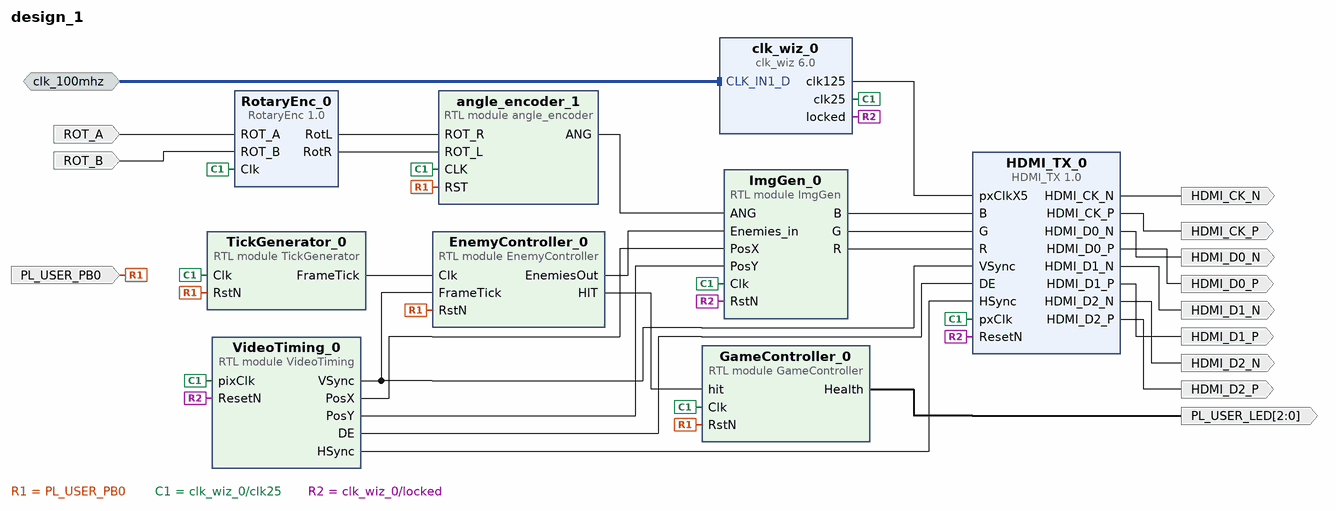
[diagram p0: block diagram of the top level]
# Vivado block design design_1, xczu3eg-sfvc784-2-e, Vivado 2025.1
create_bd_design design_1

create_bd_intf_port -mode Slave -vlnv xilinx.com:interface:diff_clock_rtl:1.0 clk_100mhz
set_property -dict {CONFIG.FREQ_HZ 100000000} [get_bd_intf_ports clk_100mhz]
create_bd_port -dir O HDMI_D0_P
create_bd_port -dir O HDMI_D0_N
create_bd_port -dir O HDMI_D1_P
create_bd_port -dir O HDMI_D1_N
create_bd_port -dir O HDMI_D2_P
create_bd_port -dir O HDMI_D2_N
create_bd_port -dir O HDMI_CK_P
create_bd_port -dir O HDMI_CK_N
create_bd_port -dir I ROT_A
create_bd_port -dir I ROT_B
create_bd_port -dir I PL_USER_PB0
create_bd_port -dir O -from 2 -to 0 PL_USER_LED

create_bd_cell -type ip -vlnv xilinx.com:ip:clk_wiz:6.0 clk_wiz_0
set_property -dict [list \
  CONFIG.CLKOUT1_JITTER 148.007 \
  CONFIG.CLKOUT1_PHASE_ERROR 84.520 \
  CONFIG.CLKOUT1_REQUESTED_OUT_FREQ 25 \
  CONFIG.CLKOUT1_USED true \
  CONFIG.CLKOUT2_JITTER 107.502 \
  CONFIG.CLKOUT2_PHASE_ERROR 84.520 \
  CONFIG.CLKOUT2_REQUESTED_OUT_FREQ 125 \
  CONFIG.CLKOUT2_USED true \
  CONFIG.CLK_IN1_BOARD_INTERFACE clk_100mhz \
  CONFIG.CLK_OUT1_PORT clk25 \
  CONFIG.CLK_OUT2_PORT clk125 \
  CONFIG.MMCM_CLKFBOUT_MULT_F 12.500 \
  CONFIG.MMCM_CLKOUT0_DIVIDE_F 50.000 \
  CONFIG.MMCM_CLKOUT1_DIVIDE 10 \
  CONFIG.MMCM_DIVCLK_DIVIDE 1 \
  CONFIG.NUM_OUT_CLKS 2 \
  CONFIG.USE_BOARD_FLOW true \
] [get_bd_cells clk_wiz_0]
create_bd_cell -type ip -vlnv JS_WUST:UCiSW:HDMI_TX:1.0 HDMI_TX_0
create_bd_cell -type module -reference VideoTiming VideoTiming_0
create_bd_cell -type module -reference ImgGen ImgGen_0
create_bd_cell -type ip -vlnv JS_WUST:UCiSW:RotaryEnc:1.0 RotaryEnc_0
create_bd_cell -type module -reference angle_encoder angle_encoder_1
create_bd_cell -type module -reference EnemyController EnemyController_0
create_bd_cell -type module -reference TickGenerator TickGenerator_0
create_bd_cell -type module -reference GameController GameController_0

# ---- connections ----

connect_bd_intf_net [get_bd_intf_ports clk_100mhz] [get_bd_intf_pins clk_wiz_0/CLK_IN1_D]
connect_bd_net [get_bd_pins EnemyController_0/EnemiesOut] [get_bd_pins ImgGen_0/Enemies_in]
connect_bd_net [get_bd_pins EnemyController_0/HIT] [get_bd_pins GameController_0/hit]
connect_bd_net [get_bd_pins GameController_0/Health] [get_bd_ports PL_USER_LED]
connect_bd_net [get_bd_pins HDMI_TX_0/HDMI_CK_N] [get_bd_ports HDMI_CK_N]
connect_bd_net [get_bd_pins HDMI_TX_0/HDMI_CK_P] [get_bd_ports HDMI_CK_P]
connect_bd_net [get_bd_pins HDMI_TX_0/HDMI_D0_N] [get_bd_ports HDMI_D0_N]
connect_bd_net [get_bd_pins HDMI_TX_0/HDMI_D0_P] [get_bd_ports HDMI_D0_P]
connect_bd_net [get_bd_pins HDMI_TX_0/HDMI_D1_N] [get_bd_ports HDMI_D1_N]
connect_bd_net [get_bd_pins HDMI_TX_0/HDMI_D1_P] [get_bd_ports HDMI_D1_P]
connect_bd_net [get_bd_pins HDMI_TX_0/HDMI_D2_N] [get_bd_ports HDMI_D2_N]
connect_bd_net [get_bd_pins HDMI_TX_0/HDMI_D2_P] [get_bd_ports HDMI_D2_P]
connect_bd_net [get_bd_pins ImgGen_0/B] [get_bd_pins HDMI_TX_0/B]
connect_bd_net [get_bd_pins ImgGen_0/G] [get_bd_pins HDMI_TX_0/G]
connect_bd_net [get_bd_pins ImgGen_0/R] [get_bd_pins HDMI_TX_0/R]
connect_bd_net -net PL_USER_PB0_1 [get_bd_ports PL_USER_PB0] \
  [get_bd_pins angle_encoder_1/RST] [get_bd_pins TickGenerator_0/RstN] [get_bd_pins EnemyController_0/RstN] \
  [get_bd_pins GameController_0/RstN]
connect_bd_net [get_bd_ports ROT_A] [get_bd_pins RotaryEnc_0/ROT_A]
connect_bd_net [get_bd_ports ROT_B] [get_bd_pins RotaryEnc_0/ROT_B]
connect_bd_net [get_bd_pins RotaryEnc_0/RotL] [get_bd_pins angle_encoder_1/ROT_R]
connect_bd_net [get_bd_pins RotaryEnc_0/RotR] [get_bd_pins angle_encoder_1/ROT_L]
connect_bd_net [get_bd_pins TickGenerator_0/FrameTick] [get_bd_pins EnemyController_0/Clk]
connect_bd_net [get_bd_pins VideoTiming_0/DE] [get_bd_pins HDMI_TX_0/DE]
connect_bd_net [get_bd_pins VideoTiming_0/HSync] [get_bd_pins HDMI_TX_0/HSync]
connect_bd_net [get_bd_pins VideoTiming_0/PosX] [get_bd_pins ImgGen_0/PosX]
connect_bd_net [get_bd_pins VideoTiming_0/PosY] [get_bd_pins ImgGen_0/PosY]
connect_bd_net [get_bd_pins VideoTiming_0/VSync] [get_bd_pins HDMI_TX_0/VSync] [get_bd_pins EnemyController_0/FrameTick]
connect_bd_net -net angle_encoder_0_ANG [get_bd_pins angle_encoder_1/ANG] [get_bd_pins ImgGen_0/ANG]
connect_bd_net [get_bd_pins clk_wiz_0/clk25] \
  [get_bd_pins HDMI_TX_0/pxClk] [get_bd_pins RotaryEnc_0/Clk] [get_bd_pins VideoTiming_0/pixClk] \
  [get_bd_pins angle_encoder_1/CLK] [get_bd_pins TickGenerator_0/Clk] [get_bd_pins GameController_0/Clk] \
  [get_bd_pins ImgGen_0/Clk]
connect_bd_net [get_bd_pins clk_wiz_0/clk125] [get_bd_pins HDMI_TX_0/pxClkX5]
connect_bd_net [get_bd_pins clk_wiz_0/locked] [get_bd_pins HDMI_TX_0/ResetN] [get_bd_pins VideoTiming_0/ResetN] [get_bd_pins ImgGen_0/RstN]

validate_bd_design
save_bd_design
